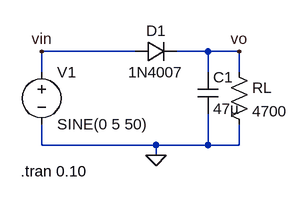
[diagram p0: schematic RECTIFICADOR_de_ONDA_con_C.asc]
RECTIFICADOR_de_ONDA_con_C.asc, the LTspice schematic file:
Version 4
SHEET 1 880 680
WIRE 128 64 -16 64
WIRE 240 64 192 64
WIRE 288 64 240 64
WIRE -16 96 -16 64
WIRE 240 96 240 64
WIRE 288 96 288 64
WIRE -16 208 -16 176
WIRE 160 208 -16 208
WIRE 240 208 240 160
WIRE 240 208 160 208
WIRE 288 208 288 176
WIRE 288 208 240 208
WIRE 160 224 160 208
FLAG 160 224 0
FLAG 288 64 vo
FLAG -16 64 vin
SYMBOL diode 128 80 R270
WINDOW 0 32 32 VTop 2
WINDOW 3 0 32 VBottom 2
SYMATTR InstName D1
SYMATTR Value 1N4007
SYMBOL res 272 80 R0
SYMATTR InstName RL
SYMATTR Value 4700
SYMBOL voltage -16 80 R0
WINDOW 123 0 0 Left 0
WINDOW 39 0 0 Left 0
SYMATTR InstName V1
SYMATTR Value SINE(0 5 50)
SYMBOL cap 224 96 R0
SYMATTR InstName C1
SYMATTR Value 47µ
TEXT -48 248 Left 2 !.tran 0.10

The netlist it stands for:
* RECTIFICADOR_de_ONDA_con_C.asc
D1 vin vo 1N4007
RL vo 0 4700
V1 vin 0 SINE(0 5 50)
C1 vo 0 47µ
.model D D
.lib standard.dio
.tran 0.10
.backanno
.end

* Results of the author's LTspice run, read from the files saved beside the schematic
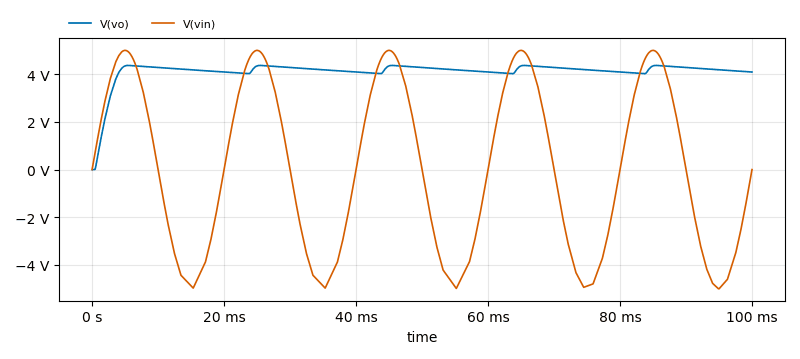
[diagram p1: Transient Analysis of RECTIFICADOR_de_ONDA_con_C.asc, plotted from the saved traces]
* Transient Analysis, 1 run:
*   V(vo): min 0 V, max 4.367 V, average 4.118 V, rms 4.149 V, last 4.092 V
*   V(vin): min -5 V, max 5 V, average 20.86 mV, rms 3.516 V, last 0 V